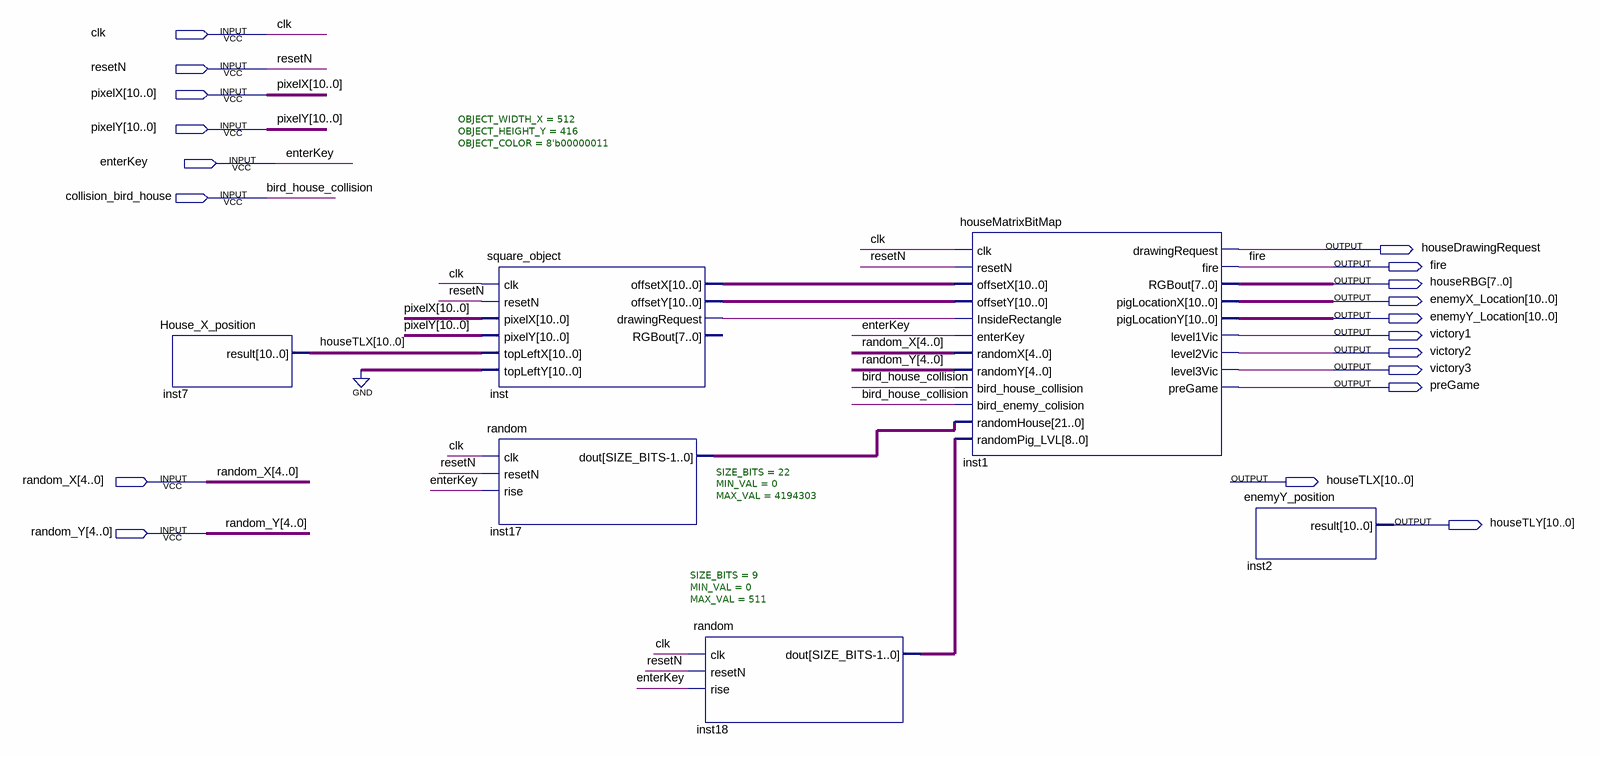
[diagram p0: schematic sheet]
// Quartus schematic House_Block_T.bdf as structural Verilog: 6 symbols, 19 pins
module House_Block_T (
  input  clk,
  input  resetN,
  input  [10:0] pixelX,
  input  [10:0] pixelY,
  input  enterKey,
  input  collision_bird_house,
  input  [4:0] random_X,
  input  [4:0] random_Y,
  output houseDrawingRequest,
  output fire,
  output [7:0] houseRBG,
  output [10:0] enemyX_Location,
  output [10:0] enemyY_Location,
  output victory1,
  output victory2,
  output victory3,
  output preGame,
  output [10:0] houseTLX,
  output [10:0] houseTLY
);

  wire inst_drawingrequest;
  wire [8:0] inst18_dout;
  wire [10:0] inst_offsetx, inst_offsety;
  wire [21:0] inst17_dout;

  House_X_position inst7 (.result(houseTLX));
  square_object #(.OBJECT_WIDTH_X(512), .OBJECT_HEIGHT_Y(416), .OBJECT_COLOR(8'b00000011)) inst (
    .clk(clk), .resetN(resetN), .pixelX(pixelX), .pixelY(pixelY), .topLeftX(houseTLX), .topLeftY({11{1'b0}}),
    .offsetX(inst_offsetx), .offsetY(inst_offsety), .drawingRequest(inst_drawingrequest));  // open: RGBout
  random #(.SIZE_BITS(22), .MIN_VAL(0), .MAX_VAL(4194303)) inst17 (
    .clk(clk), .resetN(resetN), .rise(enterKey), .dout(inst17_dout));
  random #(.SIZE_BITS(9), .MIN_VAL(0), .MAX_VAL(511)) inst18 (
    .clk(clk), .resetN(resetN), .rise(enterKey), .dout(inst18_dout));
  houseMatrixBitMap inst1 (
    .clk(clk), .resetN(resetN), .offsetX(inst_offsetx), .offsetY(inst_offsety),
    .InsideRectangle(inst_drawingrequest), .enterKey(enterKey), .randomX(random_X), .randomY(random_Y),
    .bird_house_collision(collision_bird_house), .bird_enemy_colision(collision_bird_house),
    .randomHouse(inst17_dout), .randomPig_LVL(inst18_dout), .drawingRequest(houseDrawingRequest),
    .fire(fire), .RGBout(houseRBG), .pigLocationX(enemyX_Location), .pigLocationY(enemyY_Location),
    .level1Vic(victory1), .level2Vic(victory2), .level3Vic(victory3), .preGame(preGame));
  enemyY_position inst2 (.result(houseTLY));

  // Other names for the same wires on the sheet: bird_house_collision = collision_bird_house
endmodule
